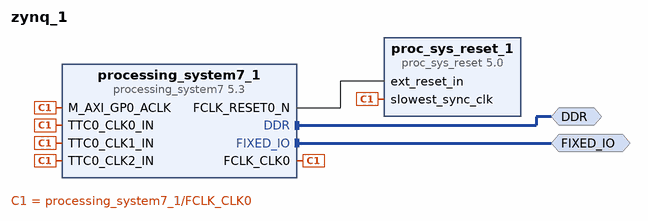
[diagram p0: block diagram of the top level]
# Vivado block design zynq_1, Vivado 2013.4
create_bd_design zynq_1

create_bd_intf_port -mode Master -vlnv xilinx.com:interface:ddrx_rtl:1.0 DDR
create_bd_intf_port -mode Master -vlnv xilinx.com:display_processing_system7:fixedio_rtl:1.0 FIXED_IO

create_bd_cell -type ip -vlnv xilinx.com:ip:processing_system7:5.3 processing_system7_1
set_property -dict [list \
  CONFIG.PCW_TTC0_CLK0_PERIPHERAL_FREQMHZ 100 \
  CONFIG.PCW_TTC0_CLK1_PERIPHERAL_FREQMHZ 100 \
  CONFIG.PCW_TTC0_CLK2_PERIPHERAL_FREQMHZ 100 \
  CONFIG.PCW_QSPI_PERIPHERAL_ENABLE 0 \
  CONFIG.PCW_ENET0_PERIPHERAL_ENABLE 1 \
  CONFIG.PCW_ENET0_ENET0_IO {MIO 16 .. 27} \
  CONFIG.PCW_SD0_PERIPHERAL_ENABLE 1 \
  CONFIG.PCW_SD0_GRP_CD_ENABLE 0 \
  CONFIG.PCW_SD0_GRP_WP_ENABLE 0 \
  CONFIG.PCW_SD0_GRP_POW_ENABLE 1 \
  CONFIG.PCW_TTC0_PERIPHERAL_ENABLE 1 \
  CONFIG.PCW_USB0_PERIPHERAL_ENABLE 0 \
  CONFIG.PCW_GPIO_MIO_GPIO_ENABLE 0 \
  CONFIG.PCW_TTC0_CLK0_PERIPHERAL_CLKSRC External \
  CONFIG.PCW_TTC0_CLK1_PERIPHERAL_CLKSRC External \
  CONFIG.PCW_TTC0_CLK2_PERIPHERAL_CLKSRC External \
] [get_bd_cells processing_system7_1]
# 2 more settings of processing_system7_1 are not shown: defaults, MIO pin electricals, DDR timing, and values the tool derives
create_bd_cell -type ip -vlnv xilinx.com:ip:proc_sys_reset:5.0 proc_sys_reset_1

# ---- connections ----

connect_bd_intf_net [get_bd_intf_ports DDR] [get_bd_intf_pins processing_system7_1/DDR]
connect_bd_intf_net [get_bd_intf_ports FIXED_IO] [get_bd_intf_pins processing_system7_1/FIXED_IO]
connect_bd_net [get_bd_pins processing_system7_1/FCLK_CLK0] \
  [get_bd_pins processing_system7_1/M_AXI_GP0_ACLK] [get_bd_pins proc_sys_reset_1/slowest_sync_clk] \
  [get_bd_pins processing_system7_1/TTC0_CLK2_IN] [get_bd_pins processing_system7_1/TTC0_CLK1_IN] \
  [get_bd_pins processing_system7_1/TTC0_CLK0_IN]
connect_bd_net [get_bd_pins processing_system7_1/FCLK_RESET0_N] [get_bd_pins proc_sys_reset_1/ext_reset_in]

validate_bd_design
save_bd_design
